# Altium schematic sheet Sheet12323.SchDoc
size A0
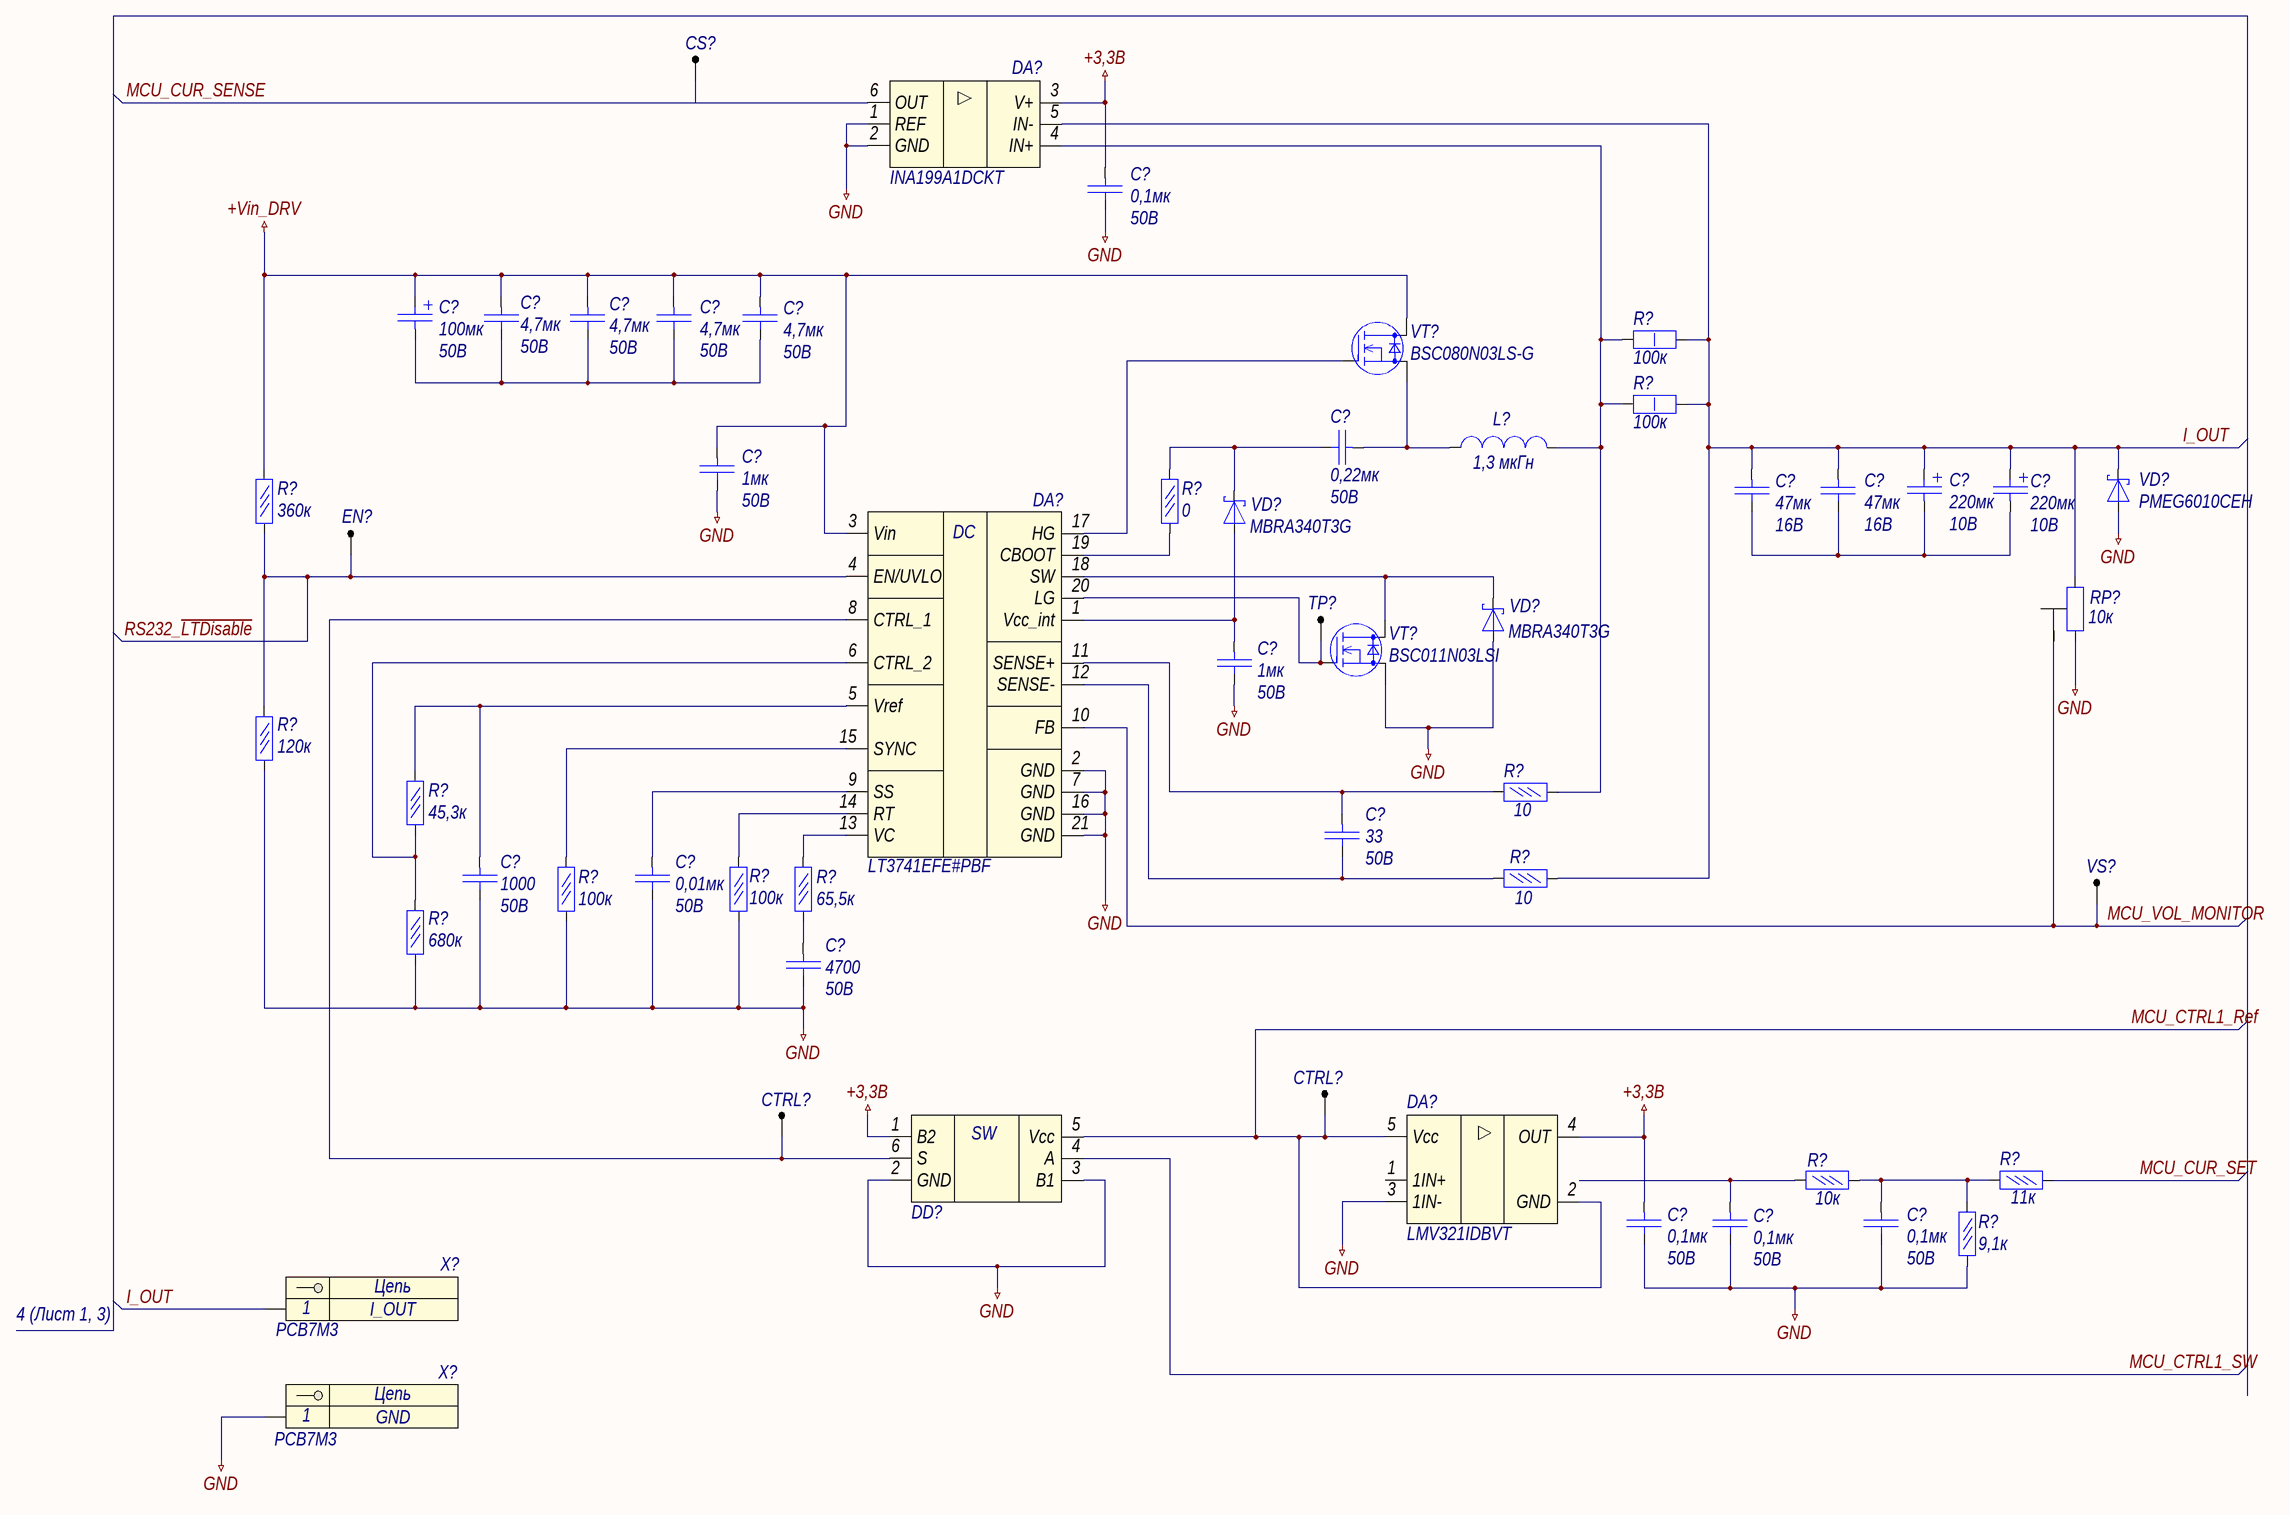
[diagram p0: Sheet12323.SchDoc]

## Parts
(Parts that share a designator on the sheet are numbered #1, #2 ... from top to bottom, then left to right.)
C?#1  Voltage: 50В  [C0805_AA]  (hidden comment: 0,1мк)
C?#2  Voltage: 50В  [C0805_AA]  (hidden comment: 100мк)
C?#3  Voltage: 50В  [C0805_AA]  (hidden comment: 4,7мк)
C?#4  Voltage: 50В  [C0805_AA]  (hidden comment: 4,7мк)
C?#5  Voltage: 50В  [C0805_AA]  (hidden comment: 4,7мк)
C?#6  Voltage: 50В  [C0805_AA]  (hidden comment: 4,7мк)
C?#7  Voltage: 50В  [C0805_AA]  (hidden comment: 0,22мк)
C?#8  Voltage: 10В  [C0805_AA]  (hidden comment: 220мк)
C?#9  Voltage: 10В  [C0805_AA]  (hidden comment: 220мк)
C?#10  Voltage: 50В  [C0805_AA]  (hidden comment: 1мк)
C?#11  Voltage: 16В  [C0805_AA]  (hidden comment: 47мк)
C?#12  Voltage: 16В  [C0805_AA]  (hidden comment: 47мк)
C?#13  Voltage: 50В  [C0805_AA]  (hidden comment: 1мк)
C?#14  Voltage: 50В  [C0805_AA]  (hidden comment: 33)
C?#15  Voltage: 50В  [C0805_AA]  (hidden comment: 1000)
C?#16  Voltage: 50В  [C0805_AA]  (hidden comment: 0,01мк)
C?#17  Voltage: 50В  [C0805_AA]  (hidden comment: 4700)
C?#18  Voltage: 50В  [C0805_AA]  (hidden comment: 0,1мк)
C?#19  Voltage: 50В  [C0805_AA]  (hidden comment: 0,1мк)
C?#20  Voltage: 50В  [C0805_AA]  (hidden comment: 0,1мк)
CS?  "1"  [0.5 x 1_round]  (value not drawn)
CTRL?#1  "1"  [0.5 x 1_round]  (value not drawn)
CTRL?#2  "1"  [0.5 x 1_round]  (value not drawn)
DA?#1  INA199A1DCKT
DA?#2  LT3741EFE#PBF
DA?#3  LMV321IDBVT
DD?  SN74LVC1G3157  (value not drawn)
EN?  "1"  [0.5 x 1_round]  (value not drawn)
L?  1,3 мкГн  [L0603_A]
R?#1  100к  [R1206]
R?#2  100к  [R1206]
R?#3  360к  [R1206]
R?#4  0  [R1206]
R?#5  120к  [R1206]
R?#6  10  [R1206]
R?#7  45,3к  [R1206]
R?#8  10  [R1206]
R?#9  100к  [R1206]
R?#10  100к  [R1206]
R?#11  65,5к  [R1206]
R?#12  680к  [R1206]
R?#13  10к  [R1206]
R?#14  11к  [R1206]
R?#15  9,1к  [R1206]
RP?  10к
TP?  "1"  [0.5 x 1_round]  (value not drawn)
VD?#1  PMEG6010CEH  [SOD123_A]
VD?#2  MBRA340T3G  [SOD123_A]
VD?#3  MBRA340T3G  [SOD123_A]
VS?  "1"  [0.5 x 1_round]  (value not drawn)
VT?#1  BSC080N03LS-G  [КТ-111В-1.02]
VT?#2  BSC011N03LSI  [КТ-111В-1.02]
X?#1  PCB7M3
X?#2  PCB7M3

## Nets
+3,3В: C?#1.2 C?#18.2 DA?#1.3(V+) DA?#3.4(OUT) DD?.1(B2)
+Vin_DRV: C?#2.1 C?#3.2 C?#4.2 C?#5.2 C?#6.2 C?#10.2 DA?#2.3(Vin) R?#3.2 VT?#1.3(D)
GND: C?#1.1 C?#10.1 C?#13.1 C?#15.1 C?#16.1 C?#17.1 C?#18.1 C?#19.1 C?#20.1 DA?#1.1(REF) DA?#1.2(GND) DA?#2.2(GND) DA?#2.7(GND) DA?#2.16(GND) DA?#2.21(GND) DA?#3.3(1IN-) DD?.2(GND) DD?.3(B1) R?#5.1 R?#9.1 R?#10.1 R?#12.1 R?#15.1 RP?.3 VD?#1.2(A) VD?#3.2(A) VT?#2.2(S) X?#2.1
I_OUT: C?#8.1 C?#9.1 C?#11.2 C?#12.2 DA?#1.5(IN-) R?#1.2 R?#2.2 R?#8.2 RP?.1 VD?#1.1(K) X?#1.1
MCU_CTRL1_Ref: CTRL?#1.1 DA?#3.2(GND) DA?#3.5(Vcc) DD?.5(Vcc)
MCU_CTRL1_SW: DD?.4(A)
MCU_CUR_SENSE: CS?.1 DA?#1.6(OUT)
MCU_CUR_SET: R?#14.1
MCU_VOL_MONITOR: DA?#2.10(FB) RP?.2 VS?.1
RS232_~{LTDisable}: DA?#2.4(EN/UVLO) EN?.1 R?#3.1 R?#5.2
NetC?#2_2: C?#2.2 C?#3.1 C?#4.1 C?#5.1 C?#6.1
NetC?#7_1: C?#7.1 R?#4.2 VD?#2.1(K)
NetC?#7_2: C?#7.2 L?.1 VT?#1.2(S)
NetC?#8_2: C?#8.2 C?#9.2 C?#11.1 C?#12.1
NetC?#13_2: C?#13.2 DA?#2.1(Vcc_int) VD?#2.2(A)
NetC?#14_1: C?#14.1 DA?#2.12(SENSE-) R?#8.1
NetC?#14_2: C?#14.2 DA?#2.11(SENSE+) R?#6.1
NetC?#15_2: C?#15.2 DA?#2.5(Vref) R?#7.2
NetC?#16_2: C?#16.2 DA?#2.9(SS)
NetC?#17_2: C?#17.2 R?#11.1
NetC?#19_2: C?#19.2 R?#13.2
NetC?#20_2: C?#20.2 R?#13.1 R?#14.2 R?#15.2
NetCTRL?#2_1: CTRL?#2.1 DA?#2.8(CTRL_1) DD?.6(S)
NetDA?#1_4: DA?#1.4(IN+) L?.2 R?#1.1 R?#2.1 R?#6.2
NetDA?#2_6: DA?#2.6(CTRL_2) R?#7.1 R?#12.2
NetDA?#2_13: DA?#2.13(VC) R?#11.2
NetDA?#2_14: DA?#2.14(RT) R?#10.2
NetDA?#2_15: DA?#2.15(SYNC) R?#9.2
NetDA?#2_17: DA?#2.17(HG) VT?#1.1(G)
NetDA?#2_18: DA?#2.18(SW) VD?#3.1(K) VT?#2.3(D)
NetDA?#2_19: DA?#2.19(CBOOT) R?#4.1
NetDA?#2_20: DA?#2.20(LG) TP?.1 VT?#2.1(G)

Not connected (* = marked no-connect by the designer): DA?#3 1(1IN+)

## Notes on the sheet
- 4 (Лист 1, 3)
- (in symbol LT3741) DC
- (in symbol SN74LVC1G3157) SW
- (in symbol x1-k) Цепь

## Library data of the parts
C?#1 C?#18-C?#20 = Конденсатор кер.: Name: CC0603KRX7R9BB104; Value: 0,1мк
C?#2 = Конденсатор поляризованный: Конденсатор пол.; Name: EEHZC1H101P; Value: 100мк
C?#3-C?#6 = Конденсатор кер.: Name: C1210C475K5RACTU; Value: 4,7мк
C?#7 = Конденсатор кер.: Name: CC0603ZRY5V9BB224; Value: 0,22мк
C?#8 C?#9 = Конденсатор поляризованный: Конденсатор пол.; Name: EEE-FP1A221AP; Value: 220мк
C?#10 C?#13 = Конденсатор кер.: Name: 08055D105KAT2A; Value: 1мк
C?#11 C?#12 = Конденсатор кер.: Name: C1210C476M4PACTU; Value: 47мк
C?#14 = Конденсатор кер.: Name: CC0603KRX7R9BB333; Value: 33
C?#15 = Конденсатор кер.: Name: CC0603KRX7R9BB102; Value: 1000
C?#16 = Конденсатор кер.: Name: CC0603KRX7R9BB103; Value: 0,01мк
C?#17 = Конденсатор кер.: Name: CC0603KPX7R9BB472; Value: 4700
CS? CTRL?#1 CTRL?#2 EN? TP? VS? = TestPoint: Test point; Comment_1: "1"
DA?#1 = INA199: Voltage output current shunt monitor
DA?#2 = LT3741: Step-Down Controller, Constant Voltage
DA?#3 = LMV321: Операционный усилитель Rail-to-rail
DD? = SN74LVC1G3157: Аналоговый переключатель, двухпозиционный
L? = Inductor: Катушка индуктивности; Name: 7443551130; Value: 1,3 мкГн
R?#1 R?#2 = Резистор  1Вт: Name: CRCW2512100KFKEG; Power rating: 1Вт; Value: 100к
R?#3 = Резистор  0,05Вт: Резистор 0,05Вт; Name: RC0603FR-07360KL; Power rating: 0,05Вт; Value: 360к
R?#4 = Резистор  0,05Вт: Резистор 0,05Вт; Name: 'RC0603FR-070RL; Power rating: 0,05Вт; Value: 0
R?#5 = Резистор  0,05Вт: Резистор 0,05Вт; Name: RC0603FR-07120KL; Power rating: 0,05Вт; Value: 120к
R?#6 R?#8 = Резистор  0,05Вт: Резистор 0,05Вт; Name: RC0603FR-0710RL; Power rating: 0,05Вт; Value: 10
R?#7 = Резистор  0,05Вт: Резистор 0,05Вт; Name: RC0603FR-0745K3L; Power rating: 0,05Вт; Value: 45,3к
R?#9 R?#10 = Резистор  0,05Вт: Резистор 0,05Вт; Name: RC0603FR-07100KL; Power rating: 0,05Вт; Value: 100к
R?#11 = Резистор  0,05Вт: Резистор 0,05Вт; Name: RT0603DRD0765K5L; Power rating: 0,05Вт; Value: 65,5к
R?#12 = Резистор  0,05Вт: Резистор 0,05Вт; Name: RC0603FR-07680KL; Power rating: 0,05Вт; Value: 680к
R?#13 = Резистор  0,05Вт: Резистор 0,05Вт; Name: RC0603FR-0710KL; Power rating: 0,05Вт; Value: 10к
R?#14 = Резистор  0,05Вт: Резистор 0,05Вт; Name: RC0603FR-0711KL; Power rating: 0,05Вт; Value: 11к
R?#15 = Резистор  0,05Вт: Резистор 0,05Вт; Name: 'RC0603FR-079K1L; Power rating: 0,05Вт; Value: 9,1к
RP? = Potentiometer
VD?#1-VD?#3 = DiodeSchottky: Диод Шоттки
  VD?#1: Name: PMEG6010CEH
  VD?#2 VD?#3: Name: MBRA340T3G
VT?#1 VT?#2 = N-Mosfet: N-канальный транзистор; Vgs: *; Rds: *; Vds: *
  VT?#1: Name: BSC080N03LS-G
  VT?#2: Name: BSC011N03LSI
X?#1 = x1-k: Разъем - 1 конт. клемма; Contact_1: I_OUT; Name: PCB7M3
X?#2 = x1-k: Разъем - 1 конт. клемма; Contact_1: GND; Name: PCB7M3